# EAGLE design untitled (EAGLE 8.7.1)
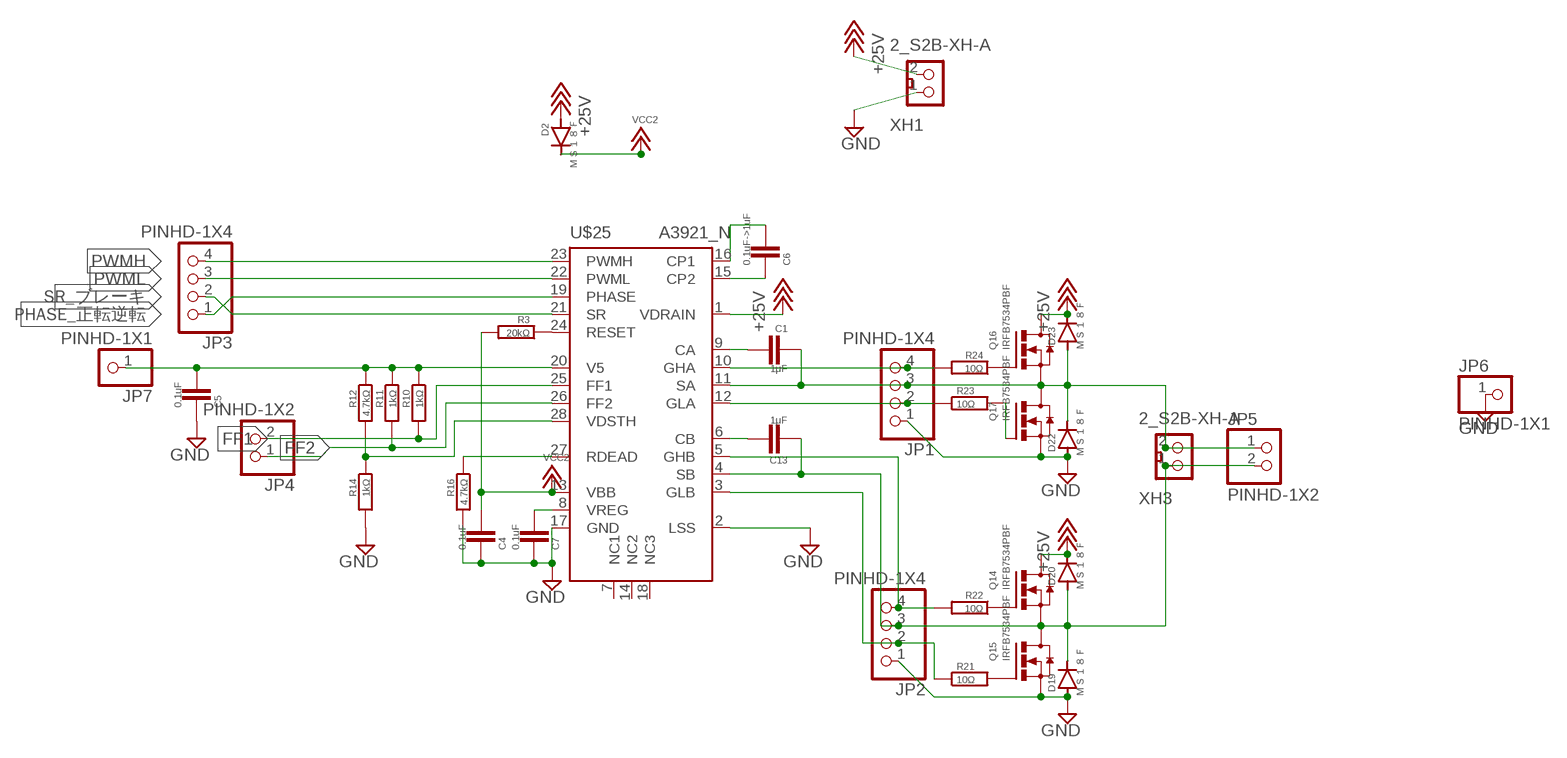
[diagram p0: schematic, sheet 1]

## Parts
C1  1μF  CAPACITOR>>2012  [2012]
C4  0.1uF  CAPACITOR>>2012  [2012]
C5  0.1uF  CAPACITOR>>2012  [2012]
C6  0.1uF->1uF  CAPACITOR>>2012  [2012]
C7  0.1uF  CAPACITOR>>2012  [2012]
C13  1μF  CAPACITOR>>2012  [2012]
D2  ＭＳ１８Ｆ  DIODE>>MS18F  [MS18F]
D19  ＭＳ１８Ｆ  DIODE>>MS18F  [MS18F]
D20  ＭＳ１８Ｆ  DIODE>>MS18F  [MS18F]
D22  ＭＳ１８Ｆ  DIODE>>MS18F  [MS18F]
D23  ＭＳ１８Ｆ  DIODE>>MS18F  [MS18F]
JP1  PINHD-1X4  [1X04]
JP2  PINHD-1X4  [1X04]
JP3  PINHD-1X4  [1X04]
JP4  PINHD-1X2  [1X02]
JP5  PINHD-1X2  [1X02]
JP6  PINHD-1X1  [1X01]
JP7  PINHD-1X1  [1X01]
Q14  IRFB7534PBF  MOSFET_N>>TO252  [TO252]
Q15  IRFB7534PBF  MOSFET_N>>TO252  [TO252]
Q16  IRFB7534PBF  MOSFET_N>>TO252  [TO252]
Q17  IRFB7534PBF  MOSFET_N>>TO252  [TO252]
R3  20kΩ  REGISTER>>2012  [2012]
R10  1kΩ  REGISTER>>2012  [2012]
R11  1kΩ  REGISTER>>2012  [2012]
R12  4.7kΩ  REGISTER>>2012  [2012]
R14  1kΩ  REGISTER>>2012  [2012]
R16  4.7kΩ  REGISTER>>2012  [2012]
R21  10Ω  REGISTER>>2012  [2012]
R22  10Ω  REGISTER>>2012  [2012]
R23  10Ω  REGISTER>>2012  [2012]
R24  10Ω  REGISTER>>2012  [2012]
U$25  A3921_N  [TSSOP28_N]
XH1  2_S2B-XH-A  [S2B-XH-A]
XH3  2_S2B-XH-A  [S2B-XH-A]

## Nets
+18V: D2.P$1(A) D20.P$2(C) D23.P$2(C) Q14.3(D) Q16.3(D) U$25.1(VDRAIN) XH1.2 ; supply symbol labelled +25V
FF1: JP4.2 R10.2 U$25.25(FF1)
FF2: JP4.1 R11.2 U$25.26(FF2)
GND: C4.2 C5.2 C7.2 D19.P$1(A) D22.P$1(A) JP1.1 JP2.1 JP6.1 Q15.2(S) Q17.2(S) R14.2 R16.2 U$25.2(LSS) U$25.17(GND) XH1.1
N$4: C6.1 U$25.16(CP1)
N$5: JP2.4 R22.2 U$25.5(GHB)
N$7: C1.2 D22.P$2(C) D23.P$1(A) JP1.3 JP5.1 Q16.2(S) Q17.3(D) U$25.11(SA) XH3.2
N$8: JP2.2 R21.1 U$25.3(GLB)
N$14: C1.1 U$25.9(CA)
N$16: JP1.4 R24.2 U$25.10(GHA)
N$19: C13.2 D19.P$2(C) D20.P$1(A) JP2.3 JP5.2 Q14.2(S) Q15.3(D) U$25.4(SB) XH3.1
N$29: C6.2 U$25.15(CP2)
N$35: JP1.2 R23.1 U$25.12(GLA)
N$36: R3.1 U$25.24(RESET)
N$37: C7.1 U$25.8(VREG)
N$41: C13.1 U$25.6(CB)
N$43: R12.2 R14.1 U$25.28(VDSTH)
N$50: Q15.1(G) R21.2
N$51: R16.1 U$25.27(RDEAD)
N$54: Q14.1(G) R22.1
N$56: Q17.1(G) R23.2
N$60: Q16.1(G) R24.1
PHASE_正転逆転: JP3.1 U$25.19(PHASE)
PWMH: JP3.4 U$25.23(PWMH)
PWML: JP3.3 U$25.22(PWML)
SR_ブレーキ: JP3.2 U$25.21(SR)
V5: C5.1 JP7.1 R10.1 R11.1 R12.1 U$25.20(V5)
VCC2: C4.1 D2.P$2(C) R3.2 U$25.13(VBB)
Unconnected: U$25.7(NC1) U$25.14(NC2) U$25.18(NC3)

## Library data of the parts
C1 C4-C7 C13 = !SMD:CAPACITOR>>
D2 D19 D20 D22 D23 = !diode:DIODE>>: DIODE
JP1-JP3 = !pinhead(ﾋﾟﾝﾍｯﾀﾞ):PINHD-1X4: PIN HEADER
JP4 JP5 = !pinhead(ﾋﾟﾝﾍｯﾀﾞ):PINHD-1X2: PIN HEADER
JP6 JP7 = !pinhead(ﾋﾟﾝﾍｯﾀﾞ):PINHD-1X1: PIN HEADER
Q14-Q17 = !FET_transister_v-reg:MOSFET_N>>
R3 R10-R12 R14 R16 R21-R24 = !SMD:REGISTER>>
U$25 = !irs(GateDriver):A3921_N
XH1 XH3 = !con-xh:2_: Wire-to-Board 2.5mm pitch top mount connector Source: http://www.jst-mfg.com/product/pdf/jpn/XH.pdf http://www.jst-mfg.com/product/detail.php?series=277

## Board
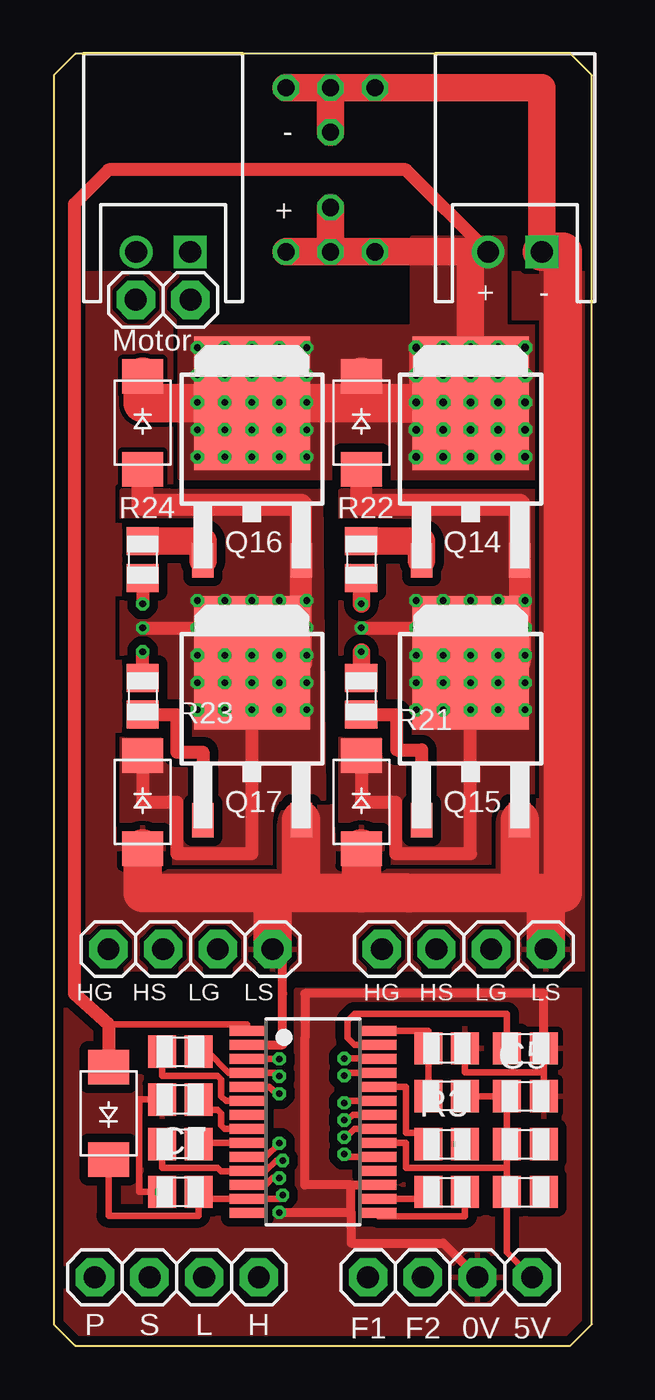
[diagram p1: board, top side]
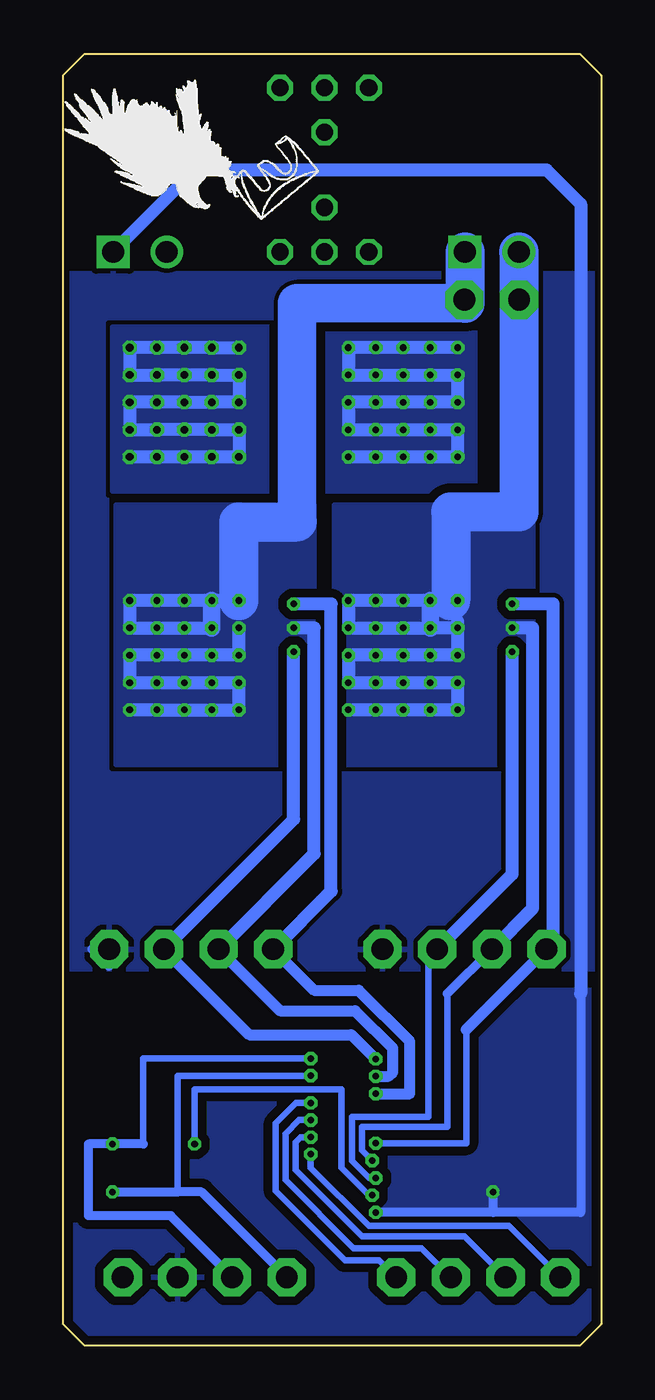
[diagram p2: board, bottom side, seen from below]

Size 25 x 60 mm. Coordinates in mm from the lower left corner, seen from the top.
Outline: 25,1 25,59 24,60 1,60 0,59 0,1 1,0 24,0 25,1
Copper layers (1*16): Top 0.035mm / dielectric 1.5mm / Bottom 0.035mm
Design rules "SeeedStudio_2layer_DRU_no_angle_20140221": minimum track width 6mil, minimum drill 12mil, track to track 6mil, track to pad 6mil, pad to pad 6mil, via to via 6mil, smd to smd 0mil, copper to edge 10mil, drill to drill 10mil, minimum pad ring 10mil, minimum via ring 6mil, stop-mask expansion 2mil, vias tented up to drill 100mil, thermal gap 10mil

### Footprints (pad centres in the part's own frame; a part is rotated, then mirrored left to right if it is on the bottom)
2012 = smd 1.3 x 1.5: 1 -0.85,0; 2 0.85,0
MS18F = smd 1.6 x 1.9: P$1 -2.15,0; P$2 2.15,0
1X04 = drill 1.016 pad 1.778 octagon: 1 -3.81,0; 2 -1.27,0; 3 1.27,0; 4 3.81,0
1X02 = drill 1.016 pad 1.778 octagon: 1 -1.27,0; 2 1.27,0
1X01 = drill 1.016 pad 1.778 octagon: 1 0,0
TO252 = smd 1 x 1.6: 1 -2.28,-4.8; 2 2.28,-4.8 | smd 5.4 x 6.2: 3 0,2.5
TSSOP28_N = smd 0.45 x 1.65: 1 -4.225,-3.05; 2 -3.575,-3.05; 3 -2.925,-3.05; 4 -2.275,-3.05; 5 -1.625,-3.05; 6 -0.975,-3.05; 7 -0.325,-3.05; 8 0.325,-3.05; 9 0.975,-3.05; 10 1.625,-3.05; 11 2.275,-3.05; 12 2.925,-3.05; 13 3.575,-3.05; 14 4.225,-3.05; 15 4.225,3.05; 16 3.575,3.05; 17 2.925,3.05; 18 2.275,3.05; 19 1.625,3.05; 20 0.975,3.05; 21 0.325,3.05; 22 -0.325,3.05; 23 -0.975,3.05; 24 -1.625,3.05; 25 -2.275,3.05; 26 -2.925,3.05; 27 -3.575,3.05; 28 -4.225,3.05
S2B-XH-A = drill 1.016 square: 1 1.25,0 | drill 1.016: 2 -1.25,0

### Placement (x,y rotation side)
C1  5.87,9.37 180 top
C4  5.87,7.14 180 top
C5  21.91,11.59 0 top
C6  18.26,7.14 0 top
C7  5.87,11.43 180 top
C13  5.87,13.65 0 top
D2  2.54,10.79 270 top
D19  14.29,25.24 90 top
D20  14.29,42.86 90 top
D22  4.13,25.24 90 top
D23  4.13,42.86 90 top
JP1  6.35,18.41 180 top
JP2  19.05,18.41 180 top
JP3  5.71,3.17 0 top
JP4  15.88,3.17 180 top
JP5  5.08,48.58 0 top
JP6  19.69,3.17 0 top
JP7  22.23,3.17 0 top
Q14  19.37,41.27 0 top
Q15  19.37,29.21 0 top
Q16  9.21,41.27 0 top
Q17  9.21,29.21 0 top
R3  18.26,9.37 0 top
R10  21.91,7.14 0 top
R11  21.91,9.37 0 top
R12  18.26,11.59 180 top
R14  18.26,13.81 0 top
R16  21.91,13.81 0 top
R21  14.29,30.16 270 top
R22  14.29,36.51 270 top
R23  4.13,30.16 270 top
R24  4.13,36.51 270 top
U$25  12.04,10.39 270 top
XH1  21.43,50.8 0 top
XH3  5.08,50.8 0 top

### Tracks (layer width: path | path; a pad name or v marks a point on that pad's centre or on a via)
+18V  (via drill 0.3, 0.35, 0.8)
  Top 0.305: U$25.1 8.99,14.92 2.54,14.92
  Top 0.61: Q16.3 v9.21,42.55 | Q14.3 16.83,43.77 v16.83,46.36 | XH1.2 16.37,54.61 2.54,54.61 0.95,53.02 0.95,16.35 2.54,14.92 D2.P$1
  Top 1.27: 16.19,43.77 14.29,43.77 | v9.21,45.09 Q16.3 8.91,44.41 | XH1.2 18.1,50.8 | XH1.2 v14.92,50.8 v12.86,50.8 | v12.86,50.8 v12.86,52.86 | v12.86,50.8 v10.79,50.8 | XH1.2 19.37,50.8 v19.37,46.36
  Top 1.778: 14.29,43.77 D20.P$2 | 16.19,43.77 Q16.3 4.13,43.77 D23.P$2
  Top 1.8: 16.19,43.77 Q14.3
  Bottom 0.61: v6.67,46.36 v7.94,46.36 v9.21,46.36 v10.48,46.36 v11.75,46.36 v11.75,45.09 v10.48,45.09 v9.21,45.09 v7.94,45.09 v6.67,45.09 v6.67,43.82 v7.94,43.82 | 7.78,43.82 v9.21,43.82 v10.48,43.82 v11.75,43.82 v11.75,42.55 v10.48,42.55 v9.21,42.55 v7.94,42.55 v6.67,42.55 v6.67,41.27 v7.94,41.27 v9.21,41.27 v10.48,41.27 v11.75,41.27 | 17.94,46.36 v16.83,46.36 | v18.1,46.36 v19.37,46.36 v20.64,46.36 v21.91,46.36 v21.91,45.09 v20.64,45.09 v19.37,45.09 v18.1,45.09 | 17.94,45.09 v16.83,45.09 v16.83,43.82 17.94,43.82 | v18.1,43.82 v19.37,43.82 v20.64,43.82 v21.91,43.82 v21.91,42.55 v20.64,42.55 v19.37,42.55 v18.1,42.55 | 17.94,42.55 v16.83,42.55 v16.83,41.27 17.94,41.27 | v18.1,41.27 v19.37,41.27 v20.64,41.27 v21.91,41.27
  pour Top (isolate 0.406, rank 2, no thermals): 22.7,47.31 20.96,47.31 20.96,51.44 16.67,51.44 16.67,47.31 5.87,47.31 5.87,40.32 22.7,40.32
  pour Bottom (isolate 0.406, rank 2, no thermals): 5.87,47.31 22.7,47.31 22.7,39.69 5.87,39.69
FF1  (via drill 0.3)
  Top 0.305: U$25.25 13.62,12.67 v13.49,12.54 | R10.2 v22.7,7.14
  Bottom 0.305: v13.49,12.54 19.69,12.54 19.69,7.14
  Bottom 0.406: v22.7,7.14 19.69,7.14 18.57,7.14 JP4.2
FF2  (via drill 0.3)
  Top 0.305: v13.49,13.34 15.09,13.34 U$25.26 | R11.2 v22.7,9.37
  Bottom 0.305: v13.49,13.34 21.27,13.34 21.27,9.37
  Bottom 0.406: 21.27,9.37 v22.7,9.37 23.81,9.37 23.81,6.03 20,6.03 JP4.1
GND  (via drill 0.3, 0.8)
  Top 0.305: C7.2 3.97,11.43 3.97,7.14 C4.2 | 22.76,12.7 19.11,12.7 R14.2 | 22.76,12.7 C5.2 | R16.2 22.76,12.7 | 11.66,13.97 11.66,14.29
  Top 0.406: 13.81,7.47 11.66,7.47 11.66,14.29 11.66,16.35 22.76,16.35 R16.2 | v10.48,6.19 13.81,6.19 | 13.81,6.19 13.81,4.76 18.1,4.76 JP6.1 | 13.81,6.19 13.81,7.47 | 13.81,7.47 U$25.17 | U$25.2 9.82,13.97 9.82,13.98 10.64,13.98 10.64,16.35 10.64,18.41 JP1.1
  Top 0.61: 10.16,20.97 11.49,21.03
  Top 1.27: 21.65,20.95 21.65,21.03 | XH1.1 22.68,58.42 v14.92,58.42 v12.86,58.42 | v12.86,58.42 v12.86,56.36 | v12.86,58.42 v10.79,58.42
  Top 1.778: 21.65,21.03 16.51,21.03 | 14.29,21.03 11.49,21.03 | 21.65,21.03 Q15.2 | 11.49,21.03 Q17.2 | JP1.1 10.16,20.97 | JP2.1 22.86,21.03 | 22.86,21.03 21.65,21.03 | D22.P$1 4.13,21.03 11.49,21.03 | XH1.1 23.65,50.8 23.65,21.03 22.86,21.03
  Top 1.8: 16.51,21.03 14.29,21.03 D19.P$1 14.29,21.11
  Bottom 0.406: 22.86,17.62 23.65,18.41 | 5.02,6.19 v10.48,6.19 | 0.95,16.35 0.95,6.19 5.02,6.19 | C4.2 5.02,6.19
  Bottom 0.61: XH1.1 18.87,54.61 2.54,54.61 0.95,53.02 0.95,16.35
  other vias: 5.02,7.14
  pour Top (isolate 0.203, rank 6): 25,17.51 0,17.51 0,49.79 25,49.79
  pour Top (isolate 0.406, rank 2): 0,16.51 7.78,16.51 7.78,13.34 11.27,13.34 11.27,16.51 25.08,16.51 25.08,0.79 24.29,0 0.95,0 0,0.95
  pour Bottom (isolate 0.203, rank 6): 25,17.51 0,17.51 0,49.79 25,49.79
  pour Bottom (isolate 0.406, rank 2): 0,16.51 25.08,16.51 25.08,0.79 24.29,0 22.86,0 0.95,0 0,0.95
N$4
  Top 0.305: U$25.16 17.41,6.82 C6.1
N$5  (via drill 0.3)
  Top 0.305: v10.48,11.7 10.37,11.7 10.32,11.75 10,12.02 U$25.5
  Top 0.813: R22.2 v14.29,34.45
  Bottom 0.508: v10.48,11.7 8.89,11.7 8.89,14.13 11.27,16.51 13.33,16.51 JP2.4
  Bottom 0.61: v14.29,34.45 12.54,34.45 12.54,21.11 JP2.4
N$7  (via drill 0.3)
  Top 0.305: C1.2 5.02,8.26 7.62,8.26 7.78,8.1 8.99,8.1 U$25.11 9.84,8.12 10.32,8.6 v10.64,8.6
  Top 0.61: 9.21,29.69 9.21,22.86 5.71,22.86 5.71,25.24 4.13,25.24 D22.P$2 | Q17.3 9.21,33.18 | v4.13,33.34 v6.67,33.34
  Top 0.813: 9.21,29.69 Q17.3
  Top 1.016: Q16.2 11.49,31.71 Q17.3 | 11.49,36.51 Q16.2 | Q16.2 11.49,39.05 4.13,39.05 D23.P$1
  Bottom 0.305: v10.64,8.6 11.11,9.07 11.11,10.16 7.14,10.16 7.14,16.35
  Bottom 0.406: JP5.1 3.81,50.8 | 7.14,16.35 JP1.3
  Bottom 0.61: v4.13,33.34 3.17,33.34 3.17,20.32 JP1.3 | v6.67,34.61 v7.94,34.61 v9.21,34.61 v10.48,34.61 v11.75,34.61 v11.75,33.34 v10.48,33.34 v9.21,33.34 v7.94,33.34 v6.67,33.34 | v11.75,29.53 v10.48,29.53 v9.21,29.53 v7.94,29.53 v6.67,29.53 v6.67,30.8 v7.94,30.8 v9.21,30.8 v10.48,30.8 v11.75,30.8 v11.75,32.07 v10.48,32.07 v9.21,32.07 v7.94,32.07 v6.67,32.07 v6.67,33.34 | 6.67,33.66 v6.67,33.34
  Bottom 0.813: v7.94,33.34 v7.94,34.61
  Bottom 1.8: 6.98,34.61 6.98,38.73 3.81,38.73 3.81,50.8 XH3.2
  pour Top (isolate 0.406, rank 3, no thermals): 3.17,39.69 3.17,22.22 10.32,22.22 10.32,25.4 12.54,25.4 12.38,39.69
  pour Bottom (isolate 0.406, rank 3, no thermals): 3.17,26.99 3.17,39.05 12.38,39.05 12.38,26.99
N$8  (via drill 0.3)
  Top 0.305: U$25.3 v10.48,13.32
  Top 0.813: R21.1 v14.29,32.23
  Bottom 0.508: v10.48,13.32 11.61,14.45 16.35,14.45 JP2.2
  Bottom 0.61: JP2.2 14.29,24.45 v14.29,32.23
N$14
  Top 0.305: C1.1 6.72,9.42 U$25.9
N$16  (via drill 0.3)
  Top 0.305: U$25.10 9.84,8.77 v10.48,9.4
  Top 0.61: R24.2 v4.13,34.45
  Bottom 0.305: v10.48,9.4 6.27,9.4 6.27,14.68
  Bottom 0.508: JP1.4 6.27,14.68
  Bottom 0.61: v4.13,34.45 2.22,34.45 2.22,18.73 JP1.4
N$19  (via drill 0.3)
  Top 0.305: v10.48,12.51 10.32,12.67 U$25.4 8.13,12.67 7.11,13.68 C13.2
  Top 0.61: Q15.3 20.32,33.34 | 19.37,29.37 19.37,22.86 15.88,22.86 15.88,25.24 14.29,25.24 D19.P$2 | v14.29,33.34 v16.83,33.34
  Top 0.813: 19.37,29.37 Q15.3
  Top 1.016: 21.65,36.51 Q14.2 | Q14.2 21.65,31.71 Q15.3 | D20.P$1 14.29,39.05 21.65,39.05 Q14.2
  Bottom 0.406: JP5.2 6.35,50.78 XH3.1
  Bottom 0.508: v10.48,12.51 9.87,12.51 9.68,12.7 9.68,13.81 11.43,15.56 14.92,15.56 JP2.3
  Bottom 0.61: v18.1,29.53 v20.64,29.53 v21.91,29.53 | v19.37,29.53 v18.1,29.53 | v18.1,29.53 v16.83,29.53 v16.83,30.8 v18.1,30.8 v19.37,30.8 v20.64,30.8 v21.91,30.8 v21.91,32.07 v20.64,32.07 v19.37,32.07 v18.1,32.07 v16.83,32.07 v16.83,33.34 | v14.29,33.34 13.33,33.34 13.33,22.86 JP2.3 | v16.83,34.61 v18.1,34.61 v19.37,34.61 v20.64,34.61 v21.91,34.61 v21.91,33.34 v20.64,33.34 v19.37,33.34 v18.1,33.34
  Bottom 0.813: v18.1,34.61 v18.1,33.34
  Bottom 1.778: 14.13,38.26 14.13,48.42 6.33,48.42
  Bottom 1.8: v16.83,34.61 16.83,38.26 14.13,38.26 | XH3.1 6.33,48.42
  pour Top (isolate 0.406, rank 3, no thermals): 13.33,22.22 20.48,22.22 20.48,25.4 22.7,25.4 22.54,39.69 13.33,39.69
  pour Bottom (isolate 0.406, rank 3, no thermals): 13.33,39.05 22.54,39.05 22.54,26.99 13.33,26.99
N$29
  Top 0.305: C6.2 19.11,6.01 15.09,6.01 U$25.15
N$35  (via drill 0.3)
  Top 0.305: v10.48,7.79 10.17,7.79 9.85,7.47 U$25.12
  Top 0.61: 4.13,31.11 R23.1 v4.13,32.23
  Bottom 0.305: v10.48,7.79 10.79,7.79 11.59,8.58 11.59,10.64 8.02,10.64 8.02,18.02
  Bottom 0.406: JP1.2 8.02,18.02
  Bottom 0.61: JP1.2 4.13,21.91 v4.13,32.23
N$36
  Top 0.305: U$25.24 16.35,12.02 16.35,9.88 17.41,9.88 R3.1
N$37
  Top 0.305: C7.1 6.72,10.95 7.62,10.95 7.78,10.79 7.78,10.23 7.94,10.07 U$25.8
N$41
  Top 0.305: U$25.6 8,11.37 7.78,11.59 7.78,12.37 7.61,12.54 5.02,12.54 C13.1
N$43
  Top 0.305: U$25.28 17.41,14.62 R14.1 R12.2
N$50
  Top 0.61: R21.2 15.93,29.31 15.93,27.67 17.09,27.67 Q15.1
N$51
  Top 0.305: U$25.27 13.97,13.97 13.65,14.29 13.65,15.08 13.97,15.4 21.06,15.4 R16.1
N$54
  Top 1.27: R22.1 17.09,37.36 Q14.1
N$56
  Top 0.61: Q17.1 6.93,27.57 5.71,27.57 5.71,29.31 R23.2
N$60
  Top 1.27: Q16.1 6.93,37.36 R24.1
PHASE_正転逆転  (via drill 0.3)
  Top 0.305: v13.49,8.89 13.62,8.77 U$25.19
  Bottom 0.305: JP3.1 4.29,5.56 10.79,5.56 13.49,8.26 v13.49,8.89
PWMH  (via drill 0.3)
  Top 0.305: v13.49,11.27 13.59,11.37 U$25.23
  Bottom 0.305: v13.49,11.27 14.17,11.27 15.12,10.32 15.12,7.19 11.91,3.97 10.32,3.97 JP3.4
PWML  (via drill 0.3)
  Top 0.305: v13.49,10.48 13.65,10.48 13.89,10.72 U$25.22
  Bottom 0.305: JP3.3 8.34,4.53 11.5,4.53 14.66,7.7 14.66,9.84 14.03,10.48 v13.49,10.48
SR_ブレーキ  (via drill 0.3)
  Top 0.305: U$25.21 13.97,10.07 13.65,9.75 v13.49,9.68
  Bottom 0.305: JP3.2 6.35,5.08 11.11,5.08 14.21,8.18 14.21,9.43 13.96,9.68 v13.49,9.68
V5
  Top 0.305: U$25.20 16.35,9.42 16.35,8.26 21.06,8.26 | 21.06,8.26 R11.1 C5.1 R12.1 | 21.06,8.26 R10.1 21.06,4.34 JP7.1
VCC2  (via drill 0.3)
  Top 0.305: D2.P$2 2.54,6.03 6.72,6.03 C4.1 6.72,6.82 U$25.13 10.47,6.82 v10.64,6.99
  Top 0.406: v18.89,9.37 R3.2
  Bottom 0.305: v10.64,6.99 10.79,6.99 12.06,8.26 12.06,11.91 18.89,11.91 v18.89,9.37

### Text on the board
tNames: - | + | + | - | Motor | HG | HS | LG | LS | HG | HS | LG | LS | P | S | L | H | F1 | F2 | 0V | 5V